# Altium schematic sheet LevelShifter.SchDoc: Top Sheet
size A4; Project: World Domination Satellite
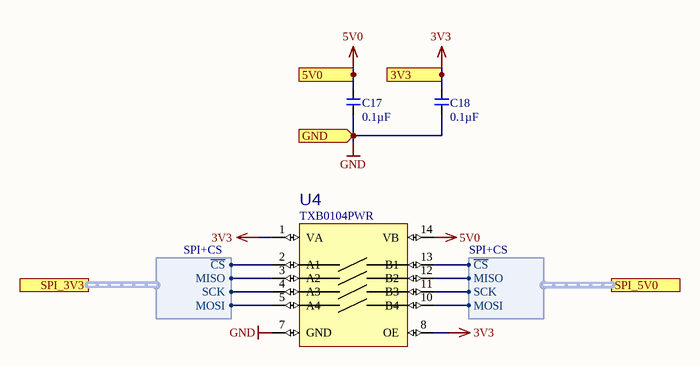
[diagram p0: LevelShifter.SchDoc]

## Parts
C17  Capacitance (shorthand): 0.1µF  [C0603]  (hidden comment: __template_cap)
C18  Capacitance (shorthand): 0.1µF  [C0603]  (hidden comment: __template_cap)
U4  Manufacturer Part Number: TXB0104PWR  [14TSSOP65]  (hidden comment: TXB0104)

## Ports
3V3 (in), 5V0 (in), GND (in), SPI_3V3 (harness SPI+CS), SPI_5V0 (harness SPI+CS)

## Harnesses
SPI+CS: ~{CS}, MISO, MOSI, SCK

## Nets
3V3: C18.1 U4.1(VA) U4.8(OE) ; port 3V3
5V0: C17.1 U4.14(VB) ; port 5V0
GND: C17.2 C18.2 U4.7(GND) ; port GND
NetU4_2: U4.2(A1) ; port SPI_3V3.~{CS}
NetU4_3: U4.3(A2) ; port SPI_3V3.MISO
NetU4_4: U4.4(A3) ; port SPI_3V3.SCK
NetU4_5: U4.5(A4) ; port SPI_3V3.MOSI
NetU4_10: U4.10(B4) ; port SPI_5V0.MOSI
NetU4_11: U4.11(B3) ; port SPI_5V0.SCK
NetU4_12: U4.12(B2) ; port SPI_5V0.MISO
NetU4_13: U4.13(B1) ; port SPI_5V0.~{CS}

## Notes on the sheet
- Title
- Size:
- Date:
- A4
- Number:
- Time:
- Revision:
- Sheet
- of
- File:

## Library data of the parts
C17 C18 = 490-1519-1-ND: CAP CER 0603 0.1µF X7R 50V 10%; Manufacturer: Murata Electronics North America; Capacitance - pF (Machine readable): #NAME?; type: capacitor; Rated Voltage: 50V; Dielectric: X7R; Supplier Part Number 1: 490-1519-1-ND; Supplier 1: Digikey
U4 = LVLSHFT_TXB0104PWR: 4 Pin Bidirectional levelshifter 5v-3.3v; Manufacturer: Texas Instruments; Translator Type: Voltage Level; Number of Circuits: 1; Channels per Circuit: 4; Voltage - VCCA: 1.2 V ~ 3.6 V; Voltage - VCCB: 1.65 V ~ 5.5 V; Output Type: Tri-State, Non-Inverted; Data Rate: 100Mbps; Value: *; Supplier 1: Digi-Key; RoHS: RoHS Compliant; Category: Integrated Circuits (ICs); Stock 1: 16134; Pricing 1: 1=1.39, 10=1.246, 100=0.9717, 500=0.8036, 1000=0.6355 (USD); Packaging: Cut Tape (CT); Channel Type: Bidirectional; Input Signal: -; Output Signal: -; Operating Temperature: -40°C ~ 85°C (TA); Features: Auto-Direction Sensing; Mounting Type: Surface Mount; Package / Case: 14-TSSOP (0.173", 4.40mm Width); Supplier Device Package: 14-TSSOP; ComponentLink1URL: http://www.ti.com/lit/ds/symlink/txb0104.pdf; ComponentLink1Description: http://www.ti.com/lit/ds/symlink/txb0104.pdf; Supplier Part Number 1: 296-21929-1-ND